# EAGLE schematic NodegLCD.v1 (EAGLE 4.13)
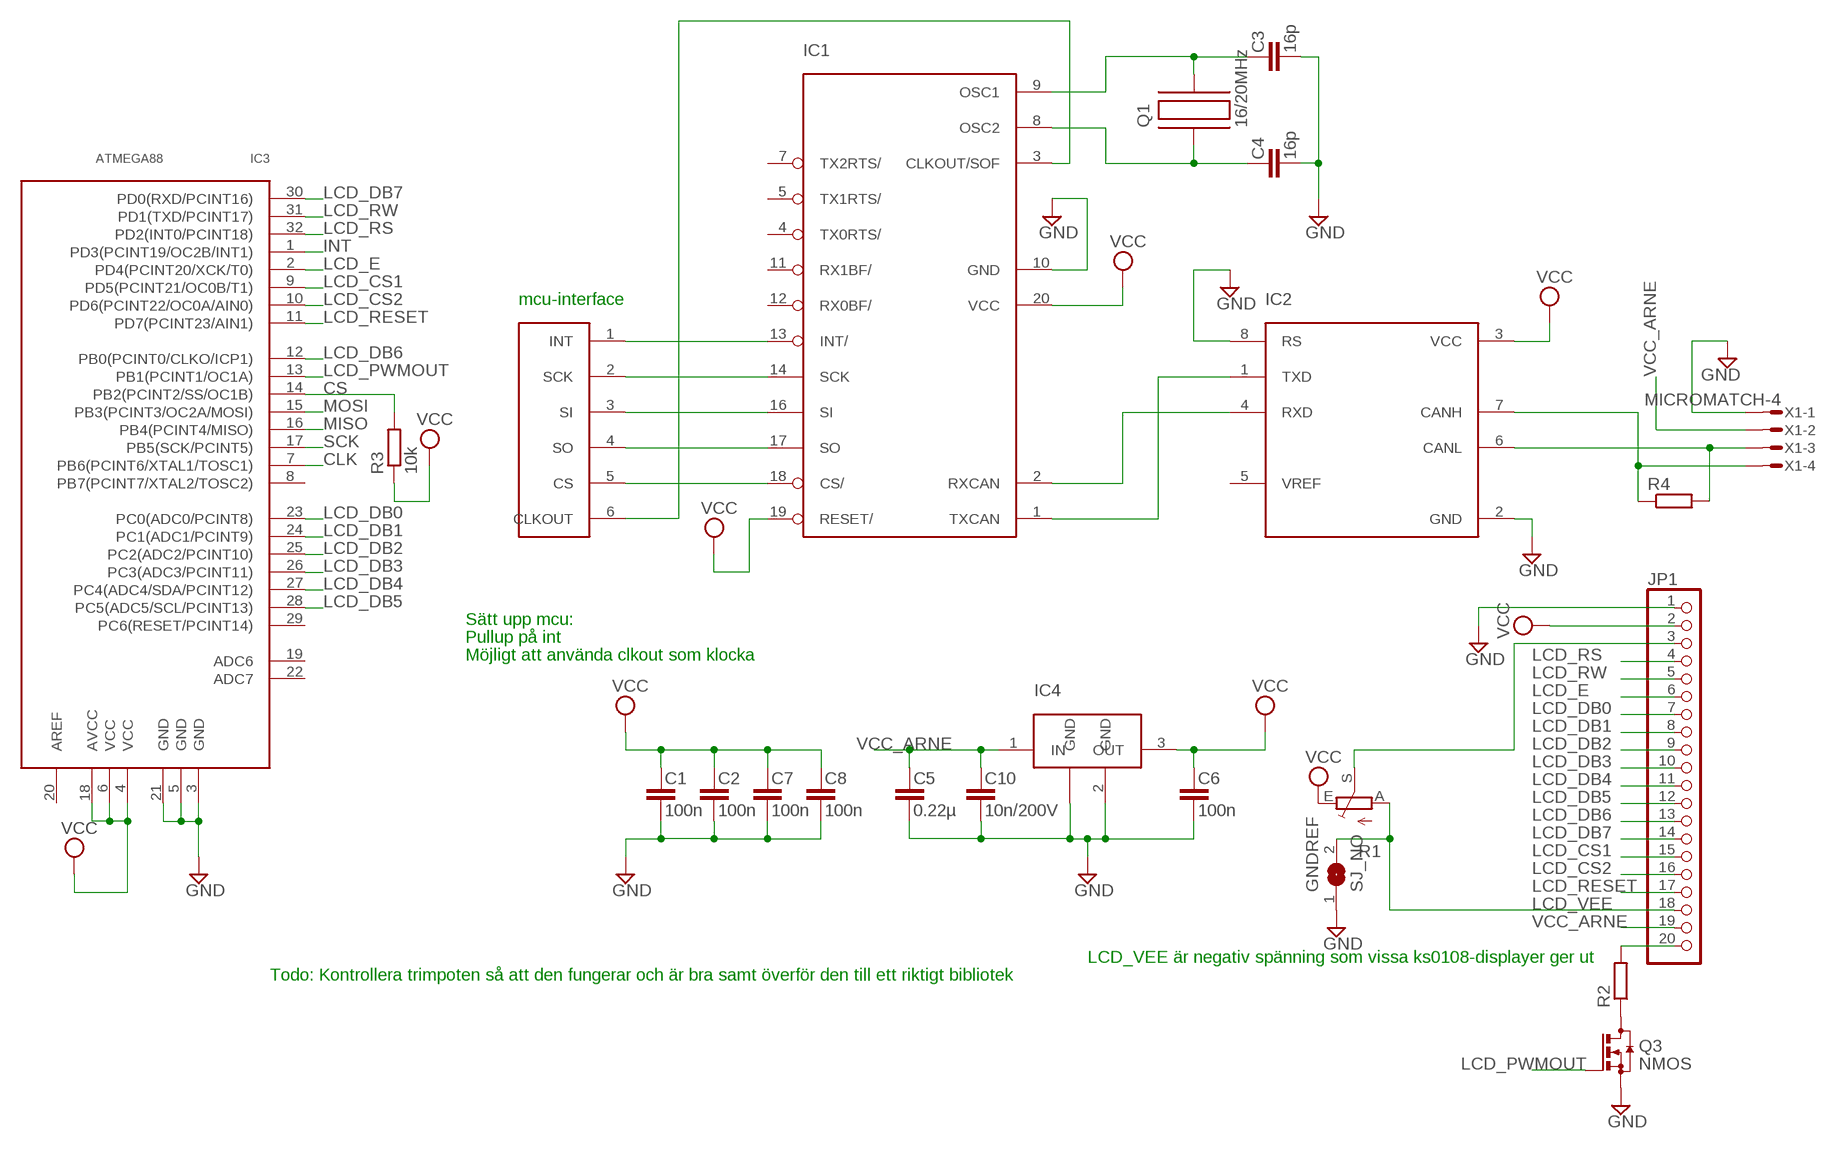
[diagram p0: schematic, sheet 1]

## Parts
C1  100n  C-EU  [C0603]
C2  100n  C-EU  [C0603]
C3  16p  C-EU  [C0603]
C4  16p  C-EU  [C0603]
C5  0.22µ  C-EU  [C0603]
C6  100n  C-EU  [C0603]
C7  100n  C-EU  [C0603]
C8  100n  C-EU  [C0603]
C10  10n/200V  C-EU  [C0603]
GNDREF  SJ_NO  [SJ_NO]
IC1  MCP2515  [TSSOP]
IC2  MCP2551  [SOIC]
IC3  ATMEGA88  [TQFP32]
IC4  LM340MP-5.0  [SOT223]
JP1  PINHD-2X10  [2X10]
Q1  16/20MHz  C-MAC-LFA147E  [SMD]
Q3  NMOS  [SOT23]
R1  TRIM_EU-CA9H  [CA9H]
R2  R-EU0207/2V  [0207/2V]
R3  10k  R-EUR0603  [R0603]
R4  R-EUR0603  [R0603]
U$1  CAN-INTERFACE  [VIA-LIST]
X1  MICROMATCH-4  [MICROMATCH-4]

## Nets
CANH: IC2.7(CANH) R4.1 X1.4
CANL: IC2.6(CANL) R4.2 X1.3
CLK: IC1.3(CLKOUT/SOF) IC3.7(PB6(PCINT6/XTAL1/TOSC1)) U$1.6(CLKOUT)
CS: IC1.18(CS/) IC3.14(PB2(PCINT2/SS/OC1B)) R3.2 U$1.5(CS)
GND: C1.2 C2.2 C3.2 C4.2 C5.2 C6.2 C7.2 C8.2 C10.2 GNDREF.1 IC1.10(GND) IC2.2(GND) IC2.8(RS) IC3.3(GND) IC3.5(GND) IC3.21(GND) IC4.2(GND) IC4.4(GND) JP1.1 Q3.2(S) X1.1
INT: IC1.13(INT/) IC3.1(PD3(PCINT19/OC2B/INT1)) U$1.1(INT)
LCD_CONTRAST: JP1.3 R1.S
LCD_CS1: IC3.9(PD5(PCINT21/OC0B/T1)) JP1.15
LCD_CS2: IC3.10(PD6(PCINT22/OC0A/AIN0)) JP1.16
LCD_DB0: IC3.23(PC0(ADC0/PCINT8)) JP1.7
LCD_DB1: IC3.24(PC1(ADC1/PCINT9)) JP1.8
LCD_DB2: IC3.25(PC2(ADC2/PCINT10)) JP1.9
LCD_DB3: IC3.26(PC3(ADC3/PCINT11)) JP1.10
LCD_DB4: IC3.27(PC4(ADC4/SDA/PCINT12)) JP1.11
LCD_DB5: IC3.28(PC5(ADC5/SCL/PCINT13)) JP1.12
LCD_DB6: IC3.12(PB0(PCINT0/CLKO/ICP1)) JP1.13
LCD_DB7: IC3.30(PD0(RXD/PCINT16)) JP1.14
LCD_E: IC3.2(PD4(PCINT20/XCK/T0)) JP1.6
LCD_PWMOUT: IC3.13(PB1(PCINT1/OC1A)) Q3.1(G)
LCD_RESET: IC3.11(PD7(PCINT23/AIN1)) JP1.17
LCD_RS: IC3.32(PD2(INT0/PCINT18)) JP1.4
LCD_RW: IC3.31(PD1(TXD/PCINT17)) JP1.5
LCD_VEE: GNDREF.2 JP1.18 R1.A
MISO: IC1.17(SO) IC3.16(PB4(PCINT4/MISO)) U$1.4(SO)
MOSI: IC1.16(SI) IC3.15(PB3(PCINT3/OC2A/MOSI)) U$1.3(SI)
N$1: IC1.2(RXCAN) IC2.4(RXD)
N$2: IC1.1(TXCAN) IC2.1(TXD)
N$3: Q3.3(D) R2.1
N$4: JP1.20 R2.2
N$12: C3.1 IC1.9(OSC1) Q1.P$2
N$13: C4.1 IC1.8(OSC2) Q1.P$1
SCK: IC1.14(SCK) IC3.17(PB5(SCK/PCINT5)) U$1.2(SCK)
VCC: C1.1 C2.1 C6.1 C7.1 C8.1 IC1.19(RESET/) IC1.20(VCC) IC2.3(VCC) IC3.4(VCC) IC3.6(VCC) IC3.18(AVCC) IC4.3(OUT) JP1.2 R1.E R3.1
VCC_ARNE: C5.1 C10.1 IC4.1(IN) JP1.19 X1.2
Unconnected: IC1.4(TX0RTS/) IC1.5(TX1RTS/) IC1.7(TX2RTS/) IC1.11(RX1BF/) IC1.12(RX0BF/) IC2.5(VREF) IC3.8(PB7(PCINT7/XTAL2/TOSC2)) IC3.19(ADC6) IC3.20(AREF) IC3.22(ADC7) IC3.29(PC6(RESET/PCINT14))

## Notes on the sheet
- mcu-interface
- Sätt upp mcu:
- Pullup på int
- Möjligt att använda clkout som klocka
- LCD_VEE är negativ spänning som vissa ks0108-displayer ger ut
- Todo: Kontrollera trimpoten så att den fungerar och är bra samt överför den till ett riktigt bibliotek

## Library data of the parts
C1-C8 C10 = rcl:C-EU
GNDREF = jumper:SJ_NO
IC1 = mcp2515:MCP2515
IC2 = mcp2551:MCP2551
IC3 = atmega88:ATMEGA88
IC4 = lm340mp:LM340MP-5.0
JP1 = pinhead-mm:PINHD-2X10
Q1 = hc49-4h-smx:C-MAC-LFA147E
Q3 = transistor:NMOS
R1 = pot:TRIM_EU-: POTENTIOMETER
R2-R4 = rcl:R-EU
U$1 = can-interface:CAN-INTERFACE
X1 = con-amp-micromatch:MICROMATCH-4: MicroMaTch 4 7-215464-4 / 0-215464-4 Drawing Number C-215464 DDEController.pdf